# EAGLE schematic AC-DC Convertor Rev2 (EAGLE 7.3.0)
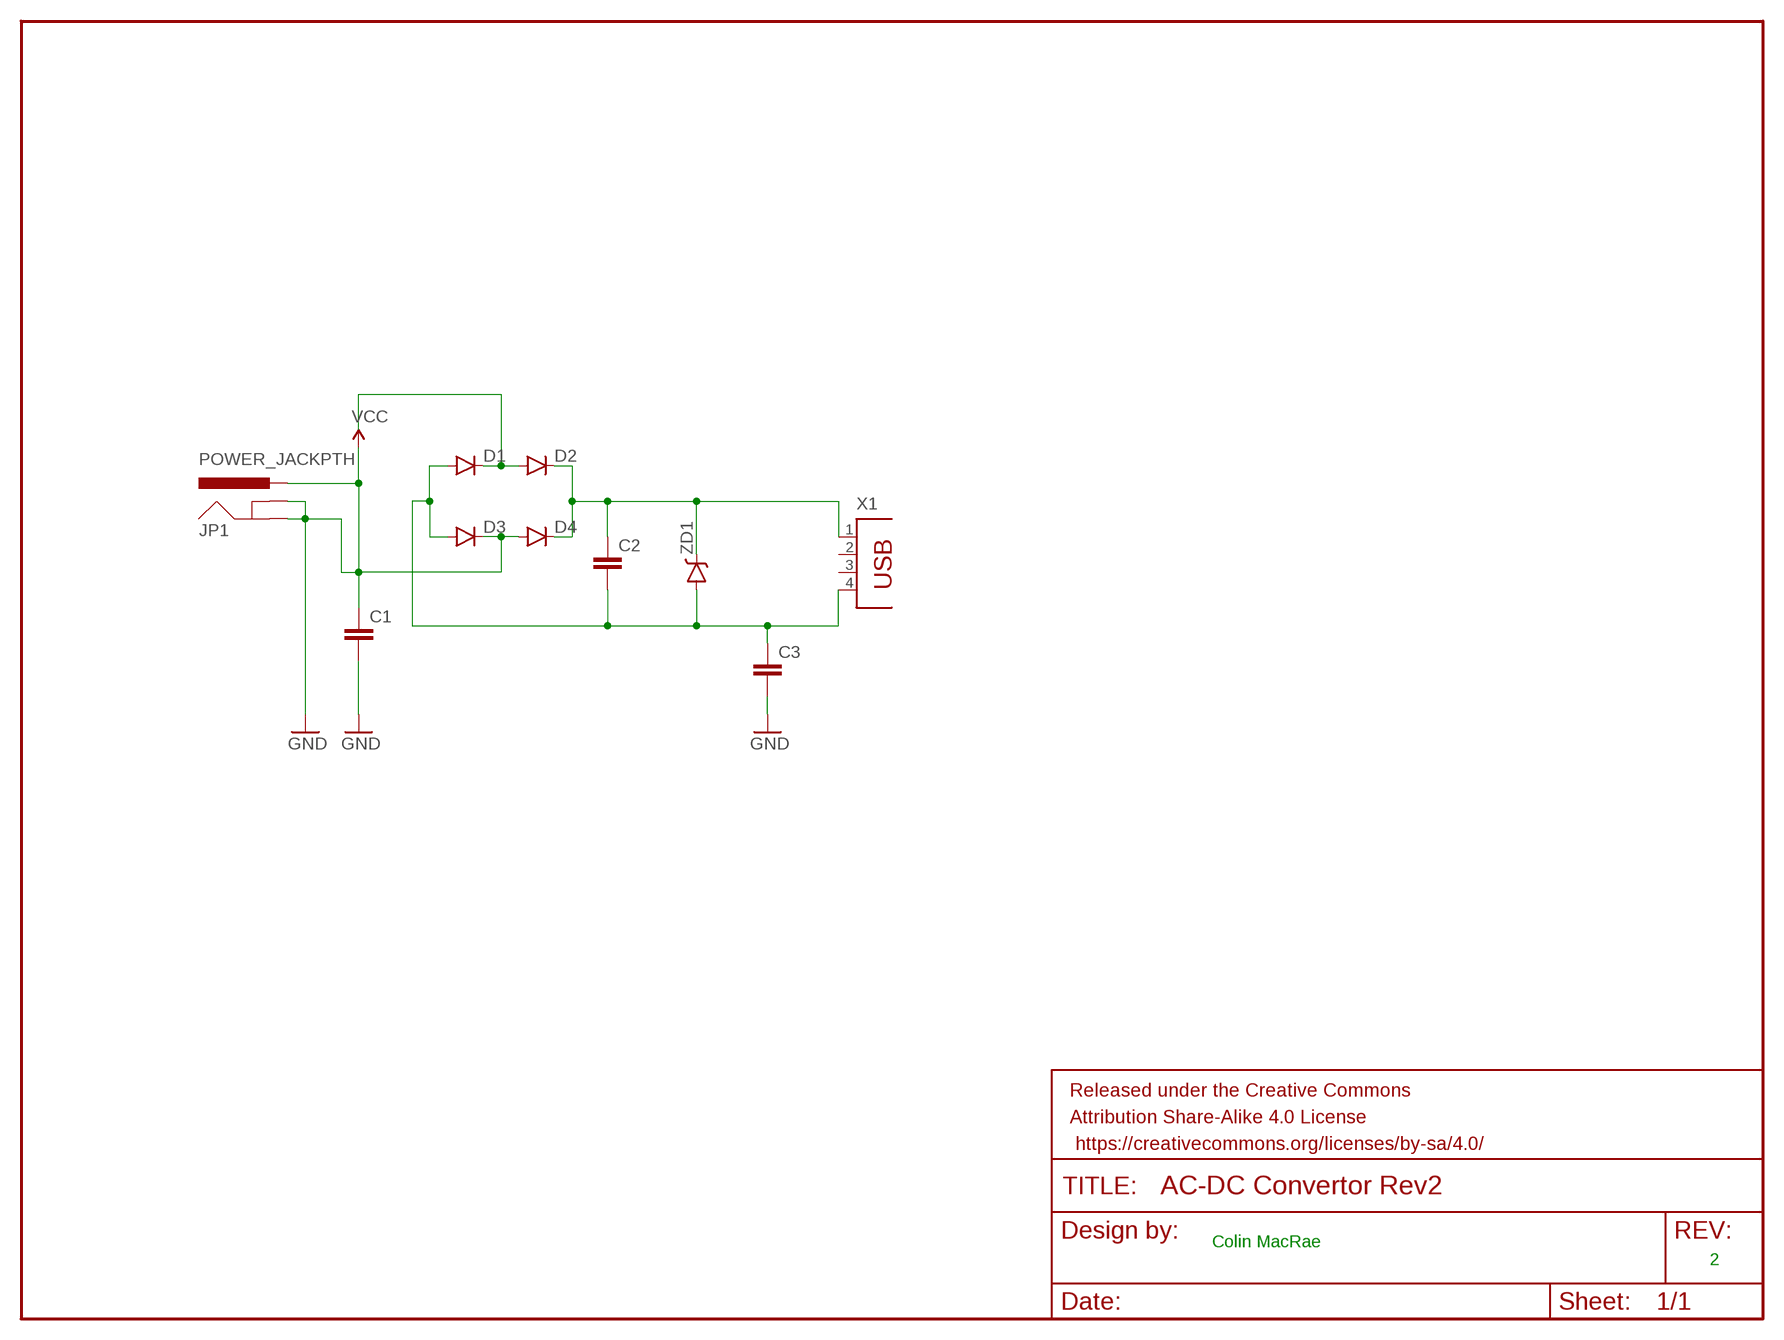
[diagram p0: schematic, sheet 1]

## Parts
C1  CAPEZ  [CAP-PTH-SMALLEZ]
C2  CAPEZ  [CAP-PTH-SMALLEZ]
C3  CAPEZ  [CAP-PTH-SMALLEZ]
D1  DIODEKIT2  [DIODE-1N4001-KIT]
D2  DIODEKIT2  [DIODE-1N4001-KIT]
D3  DIODEKIT2  [DIODE-1N4001-KIT]
D4  DIODEKIT2  [DIODE-1N4001-KIT]
FRAME1  FRAME-LETTER  [CREATIVE_COMMONS]
JP1  POWER_JACKPTH  [POWER_JACK_PTH]
X1  PN87520  [PN87520]
ZD1  V-REFERENCESMD  [SOT23-3]

## Nets
GND: C1.1 C1.2 C3.2 D3.C D4.A JP1.GND JP1.GNDBREAK JP1.PWR ; supply symbol labelled VCC
N$1: D1.C D2.A
N$2: C2.1 D2.C D4.C X1.1 ZD1.1(C)
N$3: C2.2 C3.1 D1.A D3.A X1.4 ZD1.2(A)
Unconnected: X1.2 X1.3

## Notes on the sheet
- Colin MacRae
- 2

## Library data of the parts
C1-C3 = SparkFun-Capacitors:CAP: Capacitor Standard 0603 ceramic capacitor, and 0.1" leaded capacitor.
D1-D4 = SparkFun-DiscreteSemi:DIODE: Diode These are standard reverse protection diodes and small signal diodes. SMA package can handle up to about 1A. SOD-323 can handle about 200mA. What the SOD-323 package when ordering, there are some mfgs out there that are 5-pin packages.
FRAME1 = SparkFun-Aesthetics:FRAME-LETTER: Schematic Frame Standard 8.5x11 US Letter frame
JP1 = SparkFun-Connectors:POWER_JACK: Power Jack This is the standard 5.5mm barrel jack for power. The PTH is the most common, proven, reliable, footprint. The Slot footprint only works if the mill layer is transmitted to the PCB fab house so be warned. Mating wall wart : TOL-00298 (and others); PROD_ID: CONN-08197
X1 = con-berg:PN87520: BERG USB connector; OC_FARNELL: unknown; OC_NEWARK: unknown
ZD1 = SparkFun-DiscreteSemi:V-REFERENCE: Zener diode